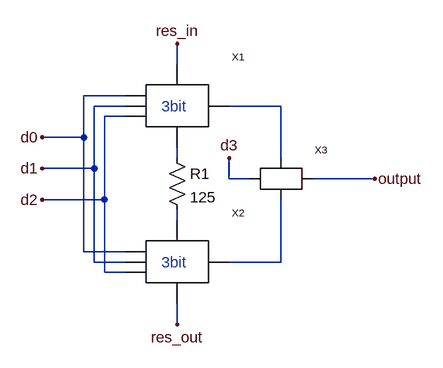
[diagram p0: schematic level3.asc]
level3.asc, the LTspice schematic file:
Version 4
SHEET 1 880 680
WIRE 96 32 96 0
WIRE 16 80 -48 80
WIRE 16 96 -32 96
WIRE 256 96 176 96
WIRE 16 112 -16 112
WIRE -48 144 -48 80
WIRE -48 144 -112 144
WIRE 96 176 96 160
WIRE 256 176 256 96
WIRE -32 192 -32 96
WIRE -32 192 -112 192
WIRE 176 208 176 176
WIRE 208 208 176 208
WIRE 400 208 304 208
WIRE -16 240 -16 112
WIRE -16 240 -112 240
WIRE 96 272 96 256
WIRE -48 320 -48 144
WIRE 16 320 -48 320
WIRE -32 336 -32 192
WIRE 16 336 -32 336
WIRE 256 336 256 240
WIRE 256 336 176 336
WIRE -16 352 -16 240
WIRE 16 352 -16 352
WIRE 96 432 96 400
FLAG 96 0 res_in
FLAG 96 432 res_out
FLAG 400 208 output
FLAG 176 176 d3
FLAG -112 144 d0
FLAG -112 192 d1
FLAG -112 240 d2
SYMBOL level2 96 96 R0
SYMATTR InstName X1
SYMBOL level2 96 336 R0
SYMATTR InstName X2
SYMBOL switch 256 208 R0
SYMATTR InstName X3
SYMBOL res 80 160 R0
SYMATTR InstName R1
SYMATTR Value 125
TEXT 72 96 Left 2 ;3bit
TEXT 72 336 Left 2 ;3bit

The netlist it stands for:
* level3.asc
XX1 d0 d1 d2 res_in N002 N001 level2  ; pins d0 d1 d2 in_res out_res out
XX2 d0 d1 d2 N003 res_out N004 level2  ; pins d0 d1 d2 in_res out_res out
XX3 d3 N001 N004 output switch  ; pins dig_in in_1 in_2 Vout
R1 N002 N003 125
* 3bit
* 3bit
.backanno
.end